# EasyEDA Pro project joystick_board_esp32_2025-03-03.epro

# Schematic esp32board
Board Name: esp32board; Create Date: 2025-02-22; Page Name: Sheet_1; Project Name: esp32; Schematic Name: esp32board; Update Date: 2025-02-22; Add into BOM: yes; Company: Your Company; Convert to PCB: yes; Date: 2025-02-21; REV: 1.0; Sheet: 1/1
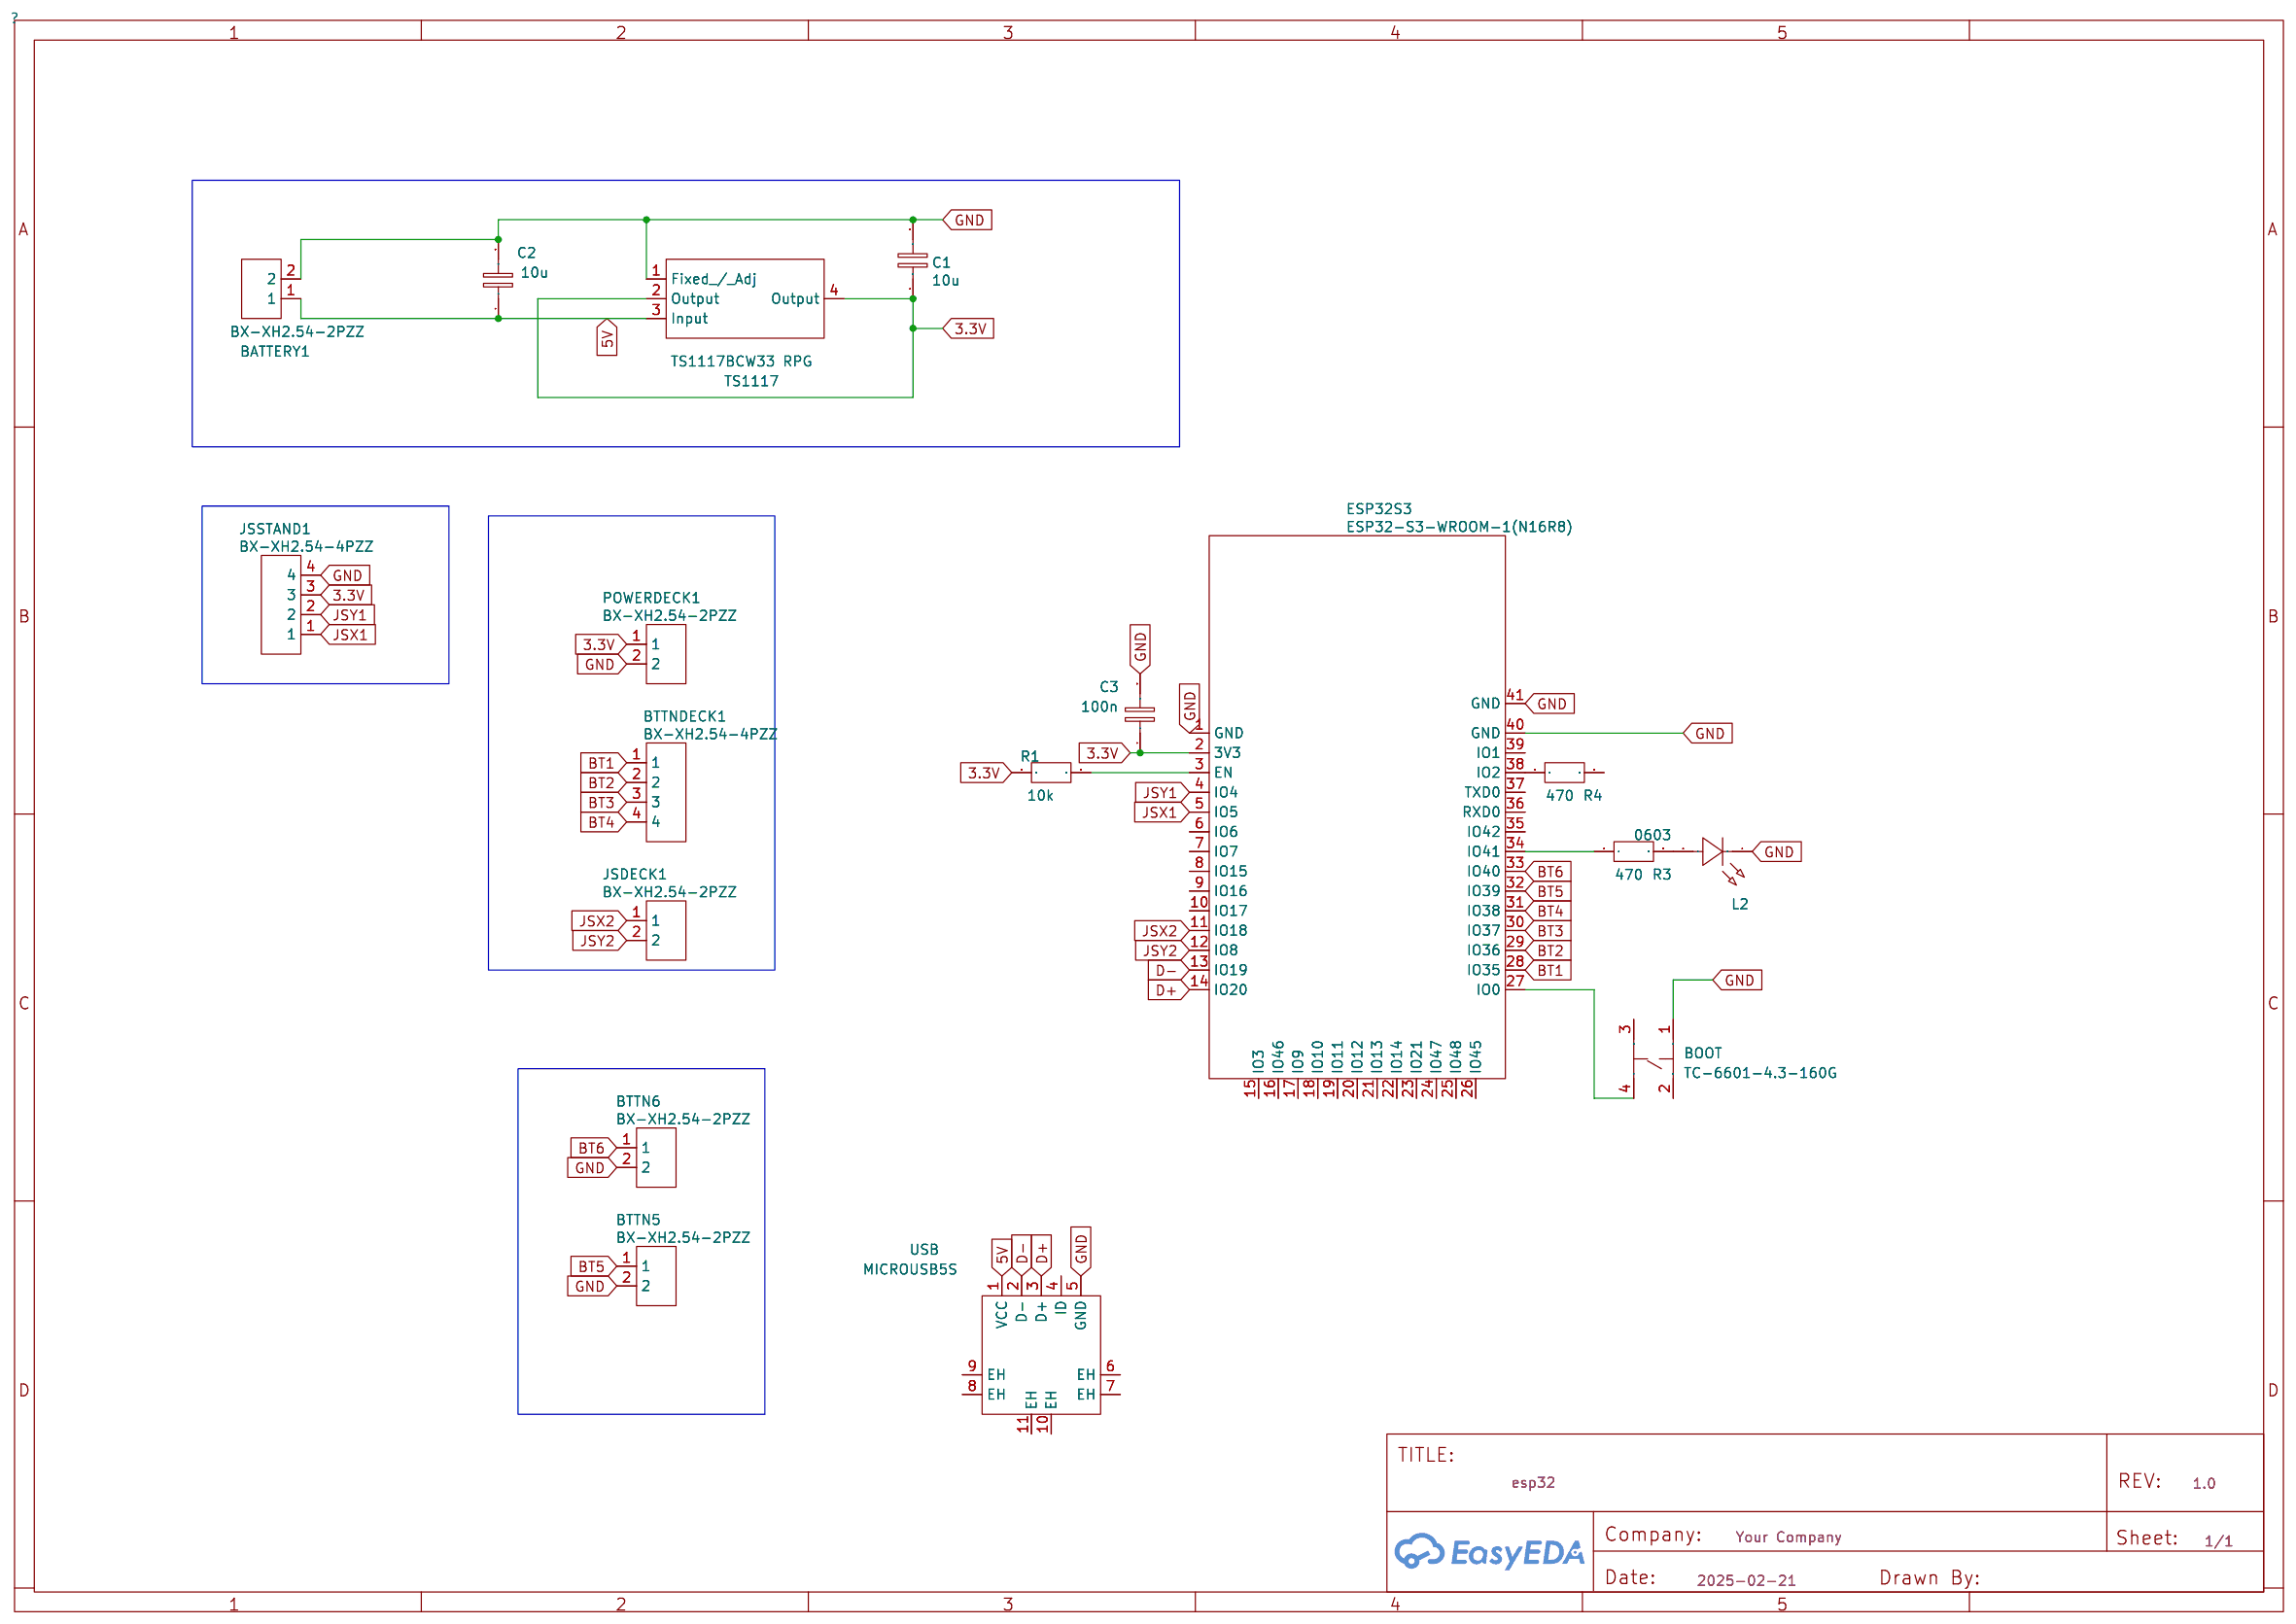
[diagram p0: schematic sheet]

## Parts
BATTERY1  BX-XH2.54-2PZZ  [CONN-TH_2P-P2.50_BX-XH2.54-2PZZ]
BOOT  TC-6601-4.3-160G  [SW-SMD_4P-L6.0-W6.0-P4.50-LS10.0_HCTL_TC-6601-XX]
BTTN5  BX-XH2.54-2PZZ  [CONN-TH_2P-P2.50_BX-XH2.54-2PZZ]
BTTN6  BX-XH2.54-2PZZ  [CONN-TH_2P-P2.50_BX-XH2.54-2PZZ]
BTTNDECK1  BX-XH2.54-4PZZ  [CONN-TH_4P-P2.50_BX-XH2.54-4PZZ]
C1  10u  [C0603]
C2  10u  [C0603]
C3  100n  [C0603]
ESP32S3  ESP32-S3-WROOM-1(N16R8)  [WIRELM-SMD_ESP32-S3-WROOM-1]
JSDECK1  BX-XH2.54-2PZZ  [CONN-TH_2P-P2.50_BX-XH2.54-2PZZ]
JSSTAND1  BX-XH2.54-4PZZ  [CONN-TH_4P-P2.50_BX-XH2.54-4PZZ]
L2  0603  [LED0603-RD_RED]
POWERDECK1  BX-XH2.54-2PZZ  [CONN-TH_2P-P2.50_BX-XH2.54-2PZZ]
R1  10k  [R0603]
R3  470  [R0603]
R4  470  [R0603]
TS1117  TS1117BCW33 RPG  [SOT-223_L6.5-W3.5-P2.30-LS7.0-BR]
USB  MICROUSB5S  [MICRO-USB_MICRO-USB-5S]

## Library data of the parts
BATTERY1 BTTN5 BTTN6 JSDECK1 POWERDECK1 = BX-XH2.54-2PZZ: Supplier: LCSC; Supplier Part: C18077833; Manufacturer: Bossie(博锡); JLCPCB Part Class: Extended Part
BOOT = TC-6601-4.3-160G: Supplier: LCSC; Supplier Part: C2845323; Manufacturer: HCTL(华灿天禄); JLCPCB Part Class: Extended Part
BTTNDECK1 JSSTAND1 = BX-XH2.54-4PZZ: Supplier: LCSC; Supplier Part: C18077835; Manufacturer: Bossie(博锡); JLCPCB Part Class: Extended Part
C1 C2 = 10u
C3 = 100n
ESP32S3 = ESP32-S3-WROOM-1(N16R8): Supplier: LCSC; Supplier Part: C2913202; Manufacturer: ESPRESSIF(乐鑫); Manufacturer Part: ESP32-S3-WROOM-1-N16R8; JLCPCB Part Class: Extended Part
L2 = 0603: Supplier: LCSC; Supplier Part: C9900014602; Manufacturer: null; JLCPCB Part Class: Extended Part
R1 = 10k
R3 R4 = 470
TS1117 = TS1117BCW33 RPG: Supplier: LCSC; Supplier Part: C410833; Manufacturer: Taiwan Semiconductor(台湾半导体); JLCPCB Part Class: Extended Part
USB = MICROUSB5S: Supplier: LCSC; Supplier Part: C9900018063; Manufacturer: null; JLCPCB Part Class: Extended Part

## Nets
3.3V: C1.1 C3.1 ESP32S3.2(3V3) JSSTAND1.3 POWERDECK1.1 R1.1 TS1117.2(Output) TS1117.4(Output)
5V: BATTERY1.1 C2.1 TS1117.3(Input) USB.1(VCC)
GND: BATTERY1.2 BOOT.1 BTTN5.2 BTTN6.2 C1.2 C2.2 C3.2 ESP32S3.1(GND) ESP32S3.40(GND) ESP32S3.41(GND) JSSTAND1.4 L2.1(K) POWERDECK1.2 TS1117.1(Fixed / Adj) USB.5(GND)
BT1: BTTNDECK1.1 ESP32S3.28(IO35)
BT2: BTTNDECK1.2 ESP32S3.29(IO36)
BT3: BTTNDECK1.3 ESP32S3.30(IO37)
BT4: BTTNDECK1.4 ESP32S3.31(IO38)
BT5: BTTN5.1 ESP32S3.32(IO39)
BT6: BTTN6.1 ESP32S3.33(IO40)
D+: ESP32S3.14(IO20) USB.3(D+)
D-: ESP32S3.13(IO19) USB.2(D-)
JSX1: ESP32S3.5(IO5) JSSTAND1.1
JSX2: ESP32S3.11(IO18) JSDECK1.1
JSY1: ESP32S3.4(IO4) JSSTAND1.2
JSY2: ESP32S3.12(IO8) JSDECK1.2
$1N6: BOOT.4 ESP32S3.27(IO0)
$1N8: ESP32S3.3(EN) R1.2
$1N1026: ESP32S3.34(IO41) R3.1
$1N1028: L2.2(A) R3.2
$1N1059: ESP32S3.38(IO2) R4.1

Not connected (* = marked no-connect by the designer): BOOT 2 3; ESP32S3 6(IO6) 7(IO7) 8(IO15) 9(IO16) 10(IO17) 15(IO3) 16(IO46) 17(IO9) 18(IO10) 19(IO11) 20(IO12) 21(IO13) 22(IO14) 23(IO21) 24(IO47) 25(IO48) 26(IO45) 35(IO42) 36(RXD0) 37(TXD0) 39(IO1); R4 2; USB 4(ID) 6(EH) 7(EH) 8(EH) 9(EH) 10(EH) 11(EH)

# Board PCB1
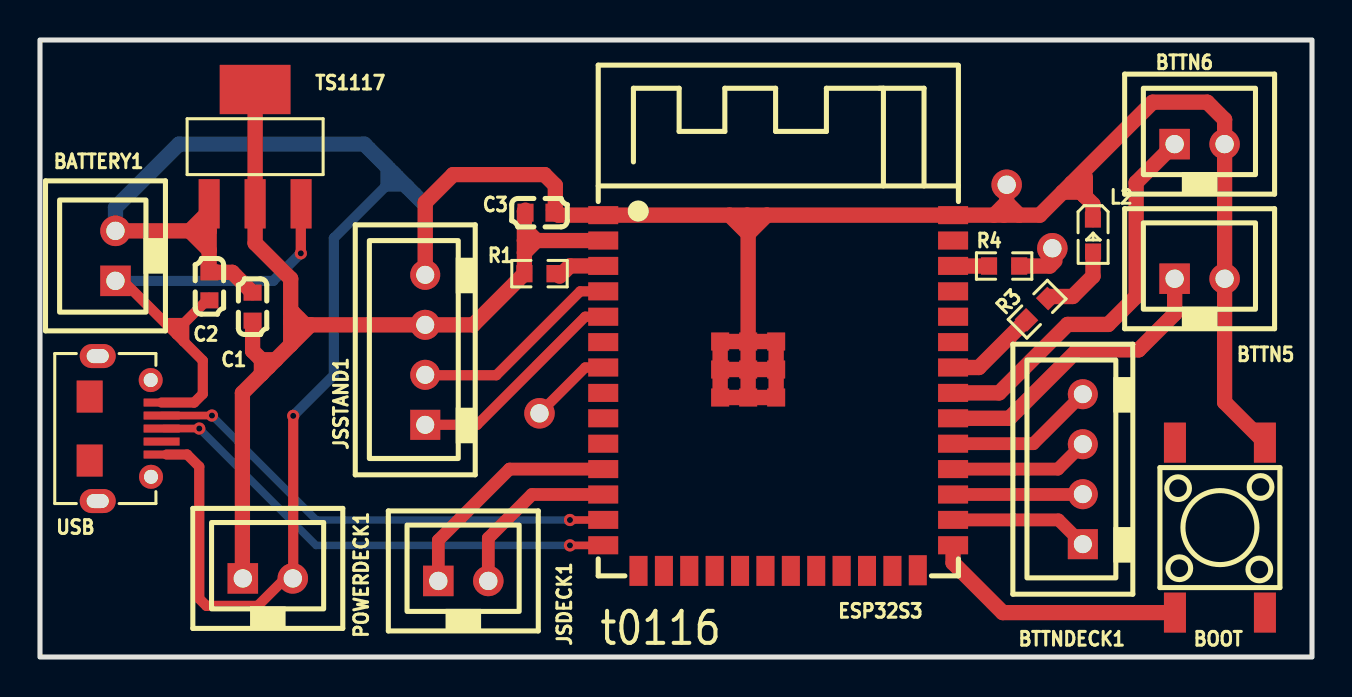
[diagram p1: board, top side]
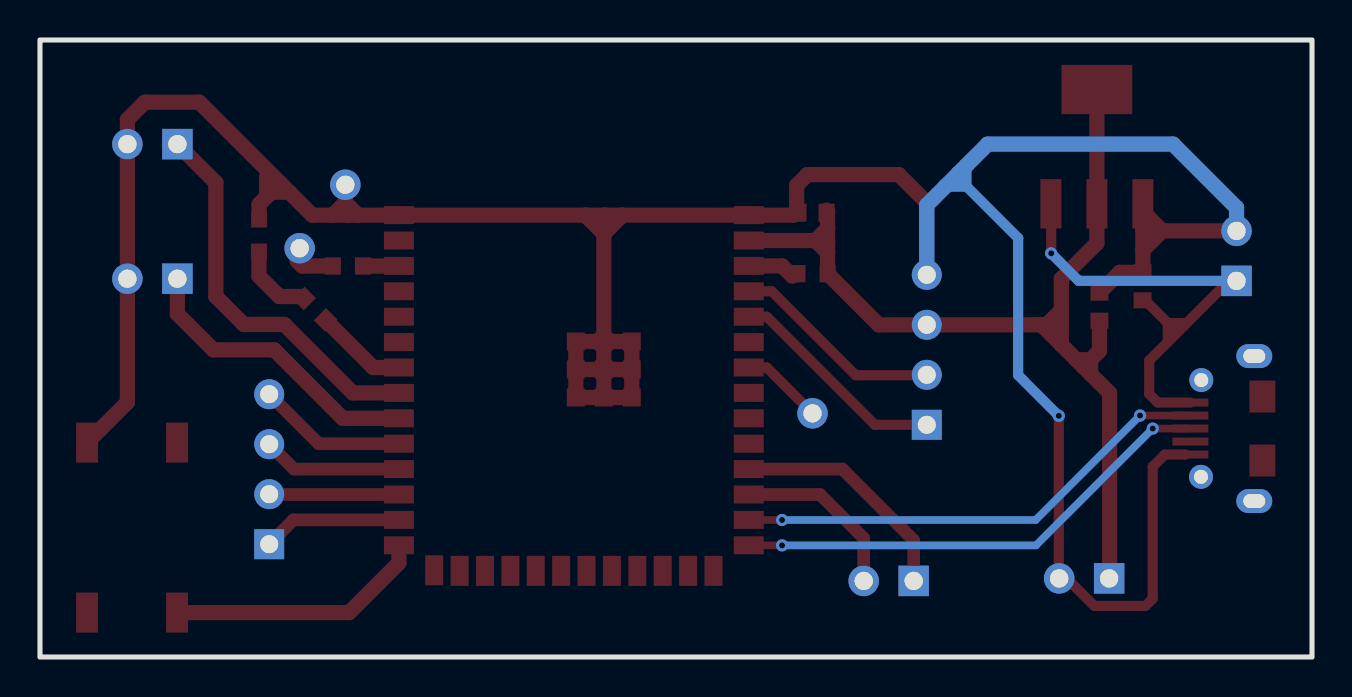
[diagram p2: board, bottom side, seen from below]

Outline 63.63 x 30.85 mm; copper layers: Top Layer, Bottom Layer. Coordinates in mm from the lower left corner of the outline.
Outline path: rectangle 0,30.85 63.63,0
Stack: Top Layer 0.035mm / Dielectric1 1.51mm FR4 er 4.5 / Bottom Layer 0.035mm

## Design rules (mm)
template: JLCPCB Capability(Two Layers Board)
spacing copperThickness1oz (default): track to track 0.102, other pairs 0.152 to 0.3
spacing copperThickness2oz: track to track 0.203, other pairs 0.152 to 0.3
track width copperThickness1oz (default): min 0.127, default 0.254, max 2.54
track width copperThickness2oz: min 0.203, default 0.254, max 2.54
differential pair differentialPair (default): width min 0.127, default 0.254, max 2.54; gap min 0.152, default 0.152
via viaSize (default): diameter min 0.5, default 0.61, max 10; hole min 0.3, default 0.305, max 6.3

## Placement (name value [footprint] x y rotation side)
BATTERY1  BX-XH2.54-2PZZ  [CONN-TH_2P-P2.50_BX-XH2.54-2PZZ]  3.78 20.06 90 top
BOOT  TC-6601-4.3-160G  [SW-SMD_4P-L6.0-W6.0-P4.50-LS10.0_HCTL_TC-6601-XX]  59.02 6.47 270 top
BTTN5  BX-XH2.54-2PZZ  [CONN-TH_2P-P2.50_BX-XH2.54-2PZZ]  58.01 18.92 0 top
BTTN6  BX-XH2.54-2PZZ  [CONN-TH_2P-P2.50_BX-XH2.54-2PZZ]  58.01 25.65 0 top
BTTNDECK1  BX-XH2.54-4PZZ  [CONN-TH_4P-P2.50_BX-XH2.54-4PZZ]  52.16 9.39 90 top
C1  10u  [C0603]  10.63 17.52 90 top
C2  10u  [C0603]  8.47 18.54 90 top
C3  100n  [C0603]  24.98 22.22 0 top
ESP32S3  ESP32-S3-WROOM-1(N16R8)  [WIRELM-SMD_ESP32-S3-WROOM-1]  36.92 13.2 0 top
JSDECK1  BX-XH2.54-2PZZ  [CONN-TH_2P-P2.50_BX-XH2.54-2PZZ]  21.17 3.8 0 top
JSSTAND1  BX-XH2.54-4PZZ  [CONN-TH_4P-P2.50_BX-XH2.54-4PZZ]  19.27 15.36 90 top
L2  0603  [LED0603-RD_RED]  52.67 21.08 270 top
NOREF  -  [Pad_e961]  24.98 12.19 0 top
NOREF#2  -  [Pad_e865]  50.64 20.44 0 top
NOREF#3  -  [Pad_e921]  48.35 23.62 0 top
POWERDECK1  BX-XH2.54-2PZZ  [CONN-TH_2P-P2.50_BX-XH2.54-2PZZ]  11.4 3.93 0 top
R1  10k  [R0603]  24.98 19.17 0 top
R3  470  [R0603]  49.88 17.39 45 top
R4  470  [R0603]  48.23 19.55 0 top
TS1117  TS1117BCW33 RPG  [SOT-223_L6.5-W3.5-P2.30-LS7.0-BR]  10.76 25.52 270 top
USB  MICROUSB5S  [MICRO-USB_MICRO-USB-5S]  4.28 11.42 90 top

## Footprints (pads in the part's own frame, mm; a bottom-side part is the same pattern mirrored in y, then rotated)
C0603
  rect 0.8x0.9 smd: 1(-0.7,0) 2(0.7,0)
CONN-TH_2P-P2.50_BX-XH2.54-2PZZ
  rect 1.524x1.524 hole 0.914: 1(-1.25,0)
  round 1.524 hole 0.914: 2(1.25,0)
CONN-TH_4P-P2.50_BX-XH2.54-4PZZ
  rect 1.5x1.5 hole 0.9: 1(-3.75,0)
  round 1.5 hole 0.9: 2(-1.25,0) 3(1.25,0) 4(3.75,0)
LED0603-RD_RED
  rect 0.8x0.8 smd: 1(-0.799,-0.004) 2(0.799,0.004)
MICRO-USB_MICRO-USB-5S
  rect 0.4x1.8 smd: 1(1.3,-1.8) 2(0.65,-1.8) 3(0.001,-1.8) 4(-0.649,-1.8) 5(-1.3,-1.8)
  round 1.2 hole 0.7: 6(-2.413,-1.27) 9(2.425,-1.254)
  oval 1.2x1.8 hole 0.7x1.1: 7(-3.625,1.396) 8(3.625,1.396)
  rect 1.6x1.3 smd: 10(-1.6,1.8) 11(1.6,1.8)
Pad_e865
  round 1.524 hole 0.914: 1(0,0)
Pad_e921
  round 1.524 hole 0.914: 2(0,0)
Pad_e961
  round 1.524 hole 0.914: 3(0,0)
R0603
  rect 0.806x0.864 smd: 1(-0.753,0) 2(0.753,0)
SOT-223_L6.5-W3.5-P2.30-LS7.0-BR
  rect 2.465x1.05 smd: 1(2.857,-2.3) 2(2.857,0) 3(2.857,2.3)
  rect 2.465x3.54 smd: 4(-2.857,0)
SW-SMD_4P-L6.0-W6.0-P4.50-LS10.0_HCTL_TC-6601-XX
  rect 2x1.1 smd: 1(-4.25,2.25) 2(4.25,2.251) 3(-4.25,-2.251) 4(4.25,-2.25)
WIRELM-SMD_ESP32-S3-WROOM-1
  rect 1.5x0.9 smd: 1(-8.75,8.895) 2(-8.75,7.625) 3(-8.75,6.355) 4(-8.75,5.085) 5(-8.75,3.815) 6(-8.75,2.545) 7(-8.75,1.275) 8(-8.75,0.005) 9(-8.75,-1.265) 10(-8.75,-2.535) 11(-8.75,-3.805) 12(-8.75,-5.075) 13(-8.75,-6.345) 14(-8.75,-7.615) 27(8.75,-7.615) 28(8.75,-6.345) 29(8.75,-5.075) 30(8.75,-3.805) 31(8.75,-2.535) 32(8.75,-1.265) 33(8.75,0.005) 34(8.75,1.275) 35(8.75,2.545) 36(8.75,3.815) 37(8.75,5.085) 38(8.75,6.355) 39(8.75,7.625) 40(8.75,8.895)
  rect 0.9x1.5 smd: 15(-6.985,-8.895) 16(-5.715,-8.895) 17(-4.445,-8.895) 18(-3.175,-8.895) 19(-1.905,-8.895) 20(-0.635,-8.895) 21(0.635,-8.895) 22(1.905,-8.895) 23(3.175,-8.895) 24(4.445,-8.895) 25(5.715,-8.895) 26(6.985,-8.865)
  rect 0.9x0.9 smd: 41(-2.9,2.575) 41(-2.9,1.175) 41(-2.9,-0.225) 41(-1.5,2.575) 41(-1.5,1.175) 41(-1.5,-0.225) 41(-0.1,2.575) 41(-0.1,1.175) 41(-0.1,-0.225)

## Nets
As in the schematic, except:
GND: BATTERY1.2 BOOT.1 BTTN5.2 BTTN6.2 C1.2 C2.2 C3.2 ESP32S3.1 ESP32S3.40 ESP32S3.41 JSSTAND1.4 L2.1 NOREF#3.2 POWERDECK1.2 TS1117.1 USB.5

Pads without a net: BOOT 2 3; ESP32S3 6 7 8 9 10 15 16 17 18 19 20 21 22 23 24 25 26 35 36 37 39; NOREF 3; NOREF#2 1; R4 2; USB 4 6 7 8 9 10 11

## Via types
v1: diameter 0.61, hole 0.305, Top Layer to Bottom Layer, 6 vias

## Routing (per net, layer and track width the routed paths; a pad name or vN(x,y) marks a point on that pad's centre or on a via; arc(x,y) is an arc through that point)
3.3V: length 54.3
  Top Layer w0.762: 13.27,16.61 12.68,16.61 12.54,16.75 ; 13.27,16.61 12.62,17.26 12.54,17.26 ; 13.27,16.61 13.53,16.61 ; 12.54,16.75 12.54,15.61 ; 12.54,16.75 12.54,17.26 ; 12.54,15.61 11.79,14.86 ; 12.54,15.61 13.53,16.6 13.53,16.61 ; 24.23,20.83 24.84,20.83 ; 24.84,20.83 ESP32S3.2 ; 24.84,20.83 24.23,21.43 ; 24.84,20.83 24.23,20.22 ; 11.08,14.16 10.13,13.2 10.13,3.95 POWERDECK1.1 ; 11.08,14.16 11.43,14.51 ; 11.08,14.16 11.07,14.16 11.07,14.86 ; 11.43,14.51 11.07,14.86 ; 11.43,14.51 11.79,14.86 ; 11.07,14.86 10.63,15.3 C1.1 ; 11.07,14.86 11.79,14.86 ; 12.54,17.26 12.54,18.92 10.76,20.69 TS1117.2 TS1117.4 ; 24.23,21.43 24.23,20.22 ; 24.23,21.43 24.23,22.29 24.29,22.35 ; 13.53,16.61 JSSTAND1.3 21.67,16.61 R1.1 24.23,20.22
5V: length 26.9
  Top Layer w0.508: 7.19,15.78 8.14,14.82 8.14,13.15 7.71,12.72 USB.1 ; 7.19,15.78 6.84,16.13 ; 7.19,15.78 7.21,15.81 7.21,16.7 ; 6.84,16.13 6.84,16.32 7.21,16.7 ; 6.84,16.13 6.36,16.6 ; v1(13.05,20.19) 13.05,22.65 TS1117.3 ; 7.21,16.7 6.46,16.7 6.36,16.6 ; 7.21,16.7 8.47,17.96 ; 6.36,16.6 3.78,19.19
  Bottom Layer w0.508: 3.78,19.19 4.16,18.81 11.67,18.81 v1(13.05,20.19)
GND: length 173.4
  Top Layer w0.508: v1(12.67,12.06) 12.67,3.95 POWERDECK1.2 12.27,3.93 10.89,2.56 8.33,2.56 7.97,2.91 7.97,9.52 7.36,10.12 6.34,10.12
  Top Layer w0.762: ESP32S3.41 ESP32S3.41 ; ESP32S3.41 ESP32S3.41 ; ESP32S3.41 ESP32S3.41 ; ESP32S3.41 ESP32S3.41 ; ESP32S3.41 ESP32S3.41 ESP32S3.41 ; ESP32S3.41 ESP32S3.41 ESP32S3.41 ; 51.15,23.24 50.01,22.1 48.98,22.1 ; 51.15,23.24 52.06,23.24 ; 51.15,23.24 51.61,23.7 ; 52.06,23.24 51.61,23.7 ; 52.06,23.24 52.24,23.07 ; 36.36,22.1 ESP32S3.40 47.72,22.1 ; 36.36,22.1 35.38,22.1 ; 36.36,22.1 35.42,21.16 ; ESP32S3.41 ESP32S3.41 ESP32S3.41 ; ESP32S3.41 35.42,21.16 ; 34.49,22.1 35.38,22.1 ; 34.49,22.1 35.42,21.16 ; 34.49,22.1 ESP32S3.1 25.93,22.1 25.78,22.25 ; 35.38,22.1 35.42,22.05 35.42,21.16 ; NOREF#3.2 48.35,22.73 ; 48.35,22.73 47.72,22.1 ; 48.35,22.73 48.35,22.22 48.23,22.1 ; 48.35,22.73 48.98,22.1 ; ESP32S3.41 ESP32S3.41 ESP32S3.41 ; 47.72,22.1 48.23,22.1 ; 48.23,22.1 48.98,22.1 ; JSSTAND1.4 19.27,22.73 20.67,24.12 25.24,24.12 25.78,23.58 25.78,22.25 ; 8.46,22.28 8.46,21.29 ; 8.46,22.28 7.49,21.31 ; 8.46,22.28 TS1117.1 ; 8.46,21.29 8.46,20.34 ; 8.46,21.29 7.51,21.29 ; 52.24,23.07 52.67,22.64 L2.1 ; 52.24,23.07 52.29,23.12 52.29,24 ; 7.49,21.31 7.51,21.29 ; 7.49,21.31 4.16,21.31 3.78,21.69 ; 7.51,21.29 8.46,20.34 ; BOOT.1 59.26,12.74 BTTN5.2 BTTN6.2 59.26,26.87 58.39,27.74 55.66,27.74 51.61,23.7 ; 8.47,19.36 8.46,19.38 8.46,20.34 ; C2.2 9.62,19.24 C1.2 ; 25.78,22.25 25.68,22.35
  Bottom Layer w0.508: 17.28,24.59 17.28,23.53 17.68,23.93 ; v1(12.67,12.06) 14.7,14.09 14.7,20.95 17.27,23.52 18.35,23.52
  Bottom Layer w0.762: 17.68,24.19 16.22,25.65 6.95,25.65 3.78,22.47 BATTERY1.2 ; 17.68,24.19 17.68,23.93 ; 17.68,24.19 19.27,22.6 JSSTAND1.4
(no net): length 6.1
  Top Layer w0.508: 25.11,12.06 25.11,12.32 27.27,14.48 ESP32S3.7
  Top Layer w0.762: R4.2 50.51,19.55 50.77,19.81
BT1: length 7
  Top Layer w0.635: ESP32S3.28 50.95,6.86 BTTNDECK1.1
BT2: length 6.5
  Top Layer w0.635: ESP32S3.29 52.15,8.13 BTTNDECK1.2
BT3: length 7
  Top Layer w0.635: BTTNDECK1.3 50.92,9.4 ESP32S3.30
BT4: length 7.5
  Top Layer w0.635: BTTNDECK1.4 49.69,10.67 ESP32S3.31
BT5: length 15
  Top Layer w0.762: BTTN5.1 56.76,17.16 54.96,15.36 51.91,15.36 48.48,11.94 ESP32S3.32
BT6: length 19.6
  Top Layer w0.762: BTTN6.1 54.83,23.72 54.83,18.03 53.43,16.63 51.4,16.63 47.98,13.21 ESP32S3.33
D+: length 24.4
  Top Layer w0.381: ESP32S3.14 28.17,5.58 v1(26.51,5.58) ; 6.19,11.42 v1(7.97,11.42)
  Bottom Layer w0.381: v1(7.97,11.42) 13.81,5.58 v1(26.51,5.58)
D-: length 24.3
  Top Layer w0.381: USB.2 v1(8.6,12.07) ; ESP32S3.13 28.17,6.85 v1(26.51,6.85)
  Bottom Layer w0.381: v1(26.51,6.85) 13.82,6.85 v1(8.6,12.07)
JSX1: length 11.1
  Top Layer w0.508: ESP32S3.5 27.27,17.02 21.86,11.61 JSSTAND1.1
JSX2: length 11.8
  Top Layer w0.635: ESP32S3.11 23.49,9.4 19.92,5.84 JSDECK1.1
JSY1: length 10.6
  Top Layer w0.508: JSSTAND1.2 19.29,14.09 22.83,14.09 27.02,18.29 ESP32S3.4
JSY2: length 8.8
  Top Layer w0.635: ESP32S3.12 24.61,8.13 22.42,5.94 JSDECK1.2
$1N6: length 13
  Top Layer w0.762: BOOT.4 48.16,2.22 45.67,4.71 ESP32S3.27
$1N8: length 2.4
  Top Layer w0.762: 25.99,19.04 26.51,19.56 ESP32S3.3
$1N1026: length 4.7
  Top Layer w0.762: ESP32S3.34 46.96,14.48 R3.1
$1N1028: length 4
  Top Layer w0.762: L2.2 52.67,20.27 52.67,19.04 51.65,18.03 50.51,18.03 R3.2
$1N1059: length 1.8
  Top Layer w0.762: ESP32S3.38 45.68,19.55 R4.1

## Text on the board
Top Silkscreen Layer: t0116
